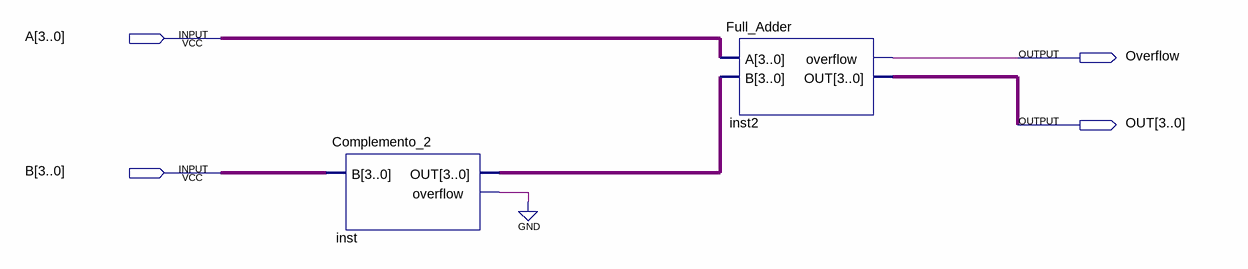
[diagram p0: schematic sheet]
// Quartus schematic subtrator.bdf as structural Verilog: 2 symbols, 4 pins
module subtrator (
  input  [3:0] A,
  input  [3:0] B,
  output Overflow,
  output [3:0] OUT
);

  wire inst_overflow;
  wire [3:0] inst_out;

  Complemento_2 inst (.B(B), .OUT(inst_out), .overflow(inst_overflow));
  Full_Adder inst2 (.A(A), .B(inst_out), .overflow(Overflow), .OUT(OUT));
  // also tied to GND on the sheet: inst_overflow
endmodule
